# EAGLE design mxboard (EAGLE 7.1.0)
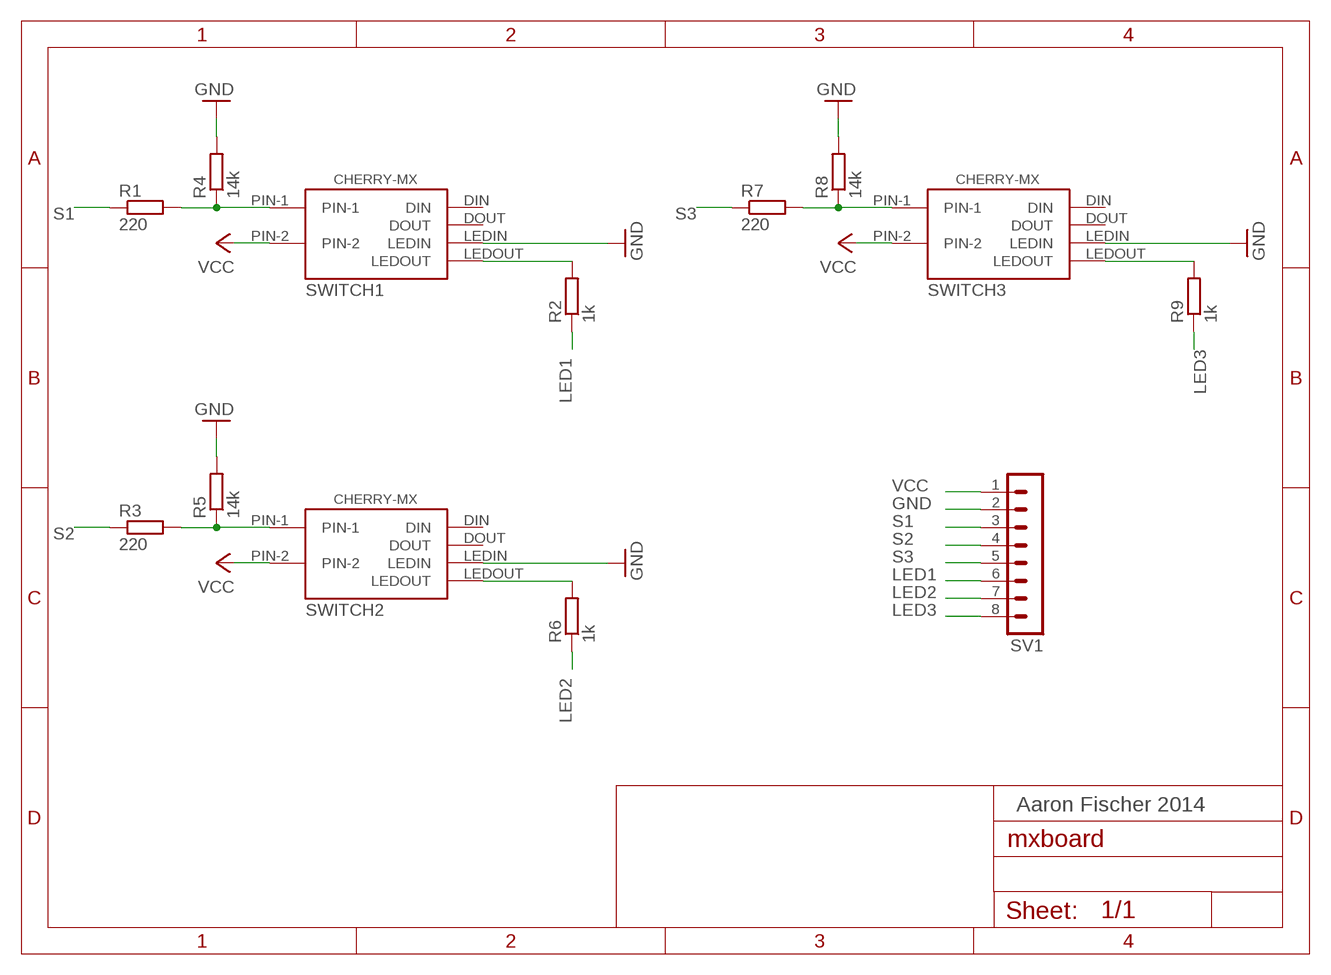
[diagram p0: schematic, sheet 1]

## Parts
R1  220  R-EU_R0805  [R0805]
R2  1k  R-EU_R0805  [R0805]
R3  220  R-EU_R0805  [R0805]
R4  14k  R-EU_R0805  [R0805]
R5  14k  R-EU_R0805  [R0805]
R6  1k  R-EU_R0805  [R0805]
R7  220  R-EU_R0805  [R0805]
R8  14k  R-EU_R0805  [R0805]
R9  1k  R-EU_R0805  [R0805]
SV1  MA08-1  [MA08-1]
SWITCH1  CHERRY-MX-I  [CHERRY-MX-I]
SWITCH2  CHERRY-MX-I  [CHERRY-MX-I]
SWITCH3  CHERRY-MX-I  [CHERRY-MX-I]

## Nets
GND: R4.2 R5.2 R8.2 SV1.2 SWITCH1.LEDIN SWITCH2.LEDIN SWITCH3.LEDIN
LED1: R2.1 SV1.6
LED2: R6.1 SV1.7
LED3: R9.1 SV1.8
N$1: R1.2 R4.1 SWITCH1.PIN-1
N$3: R2.2 SWITCH1.LEDOUT
N$5: R3.2 R5.1 SWITCH2.PIN-1
N$7: R6.2 SWITCH2.LEDOUT
N$9: R7.2 R8.1 SWITCH3.PIN-1
N$11: R9.2 SWITCH3.LEDOUT
S1: R1.1 SV1.3
S2: R3.1 SV1.4
S3: R7.1 SV1.5
VCC: SV1.1 SWITCH1.PIN-2 SWITCH2.PIN-2 SWITCH3.PIN-2
Unconnected: SWITCH1.DIN SWITCH1.DOUT SWITCH2.DIN SWITCH2.DOUT SWITCH3.DIN SWITCH3.DOUT

## Notes on the sheet
- Aaron Fischer 2014

## Library data of the parts
R1-R9 = resistor:R-EU_: RESISTOR, European symbol; SPICEPREFIX: R
SV1 = con-lstb:MA08-1: PIN HEADER; OC_FARNELL: unknown; OC_NEWARK: unknown
SWITCH1-SWITCH3 = cherrymx:CHERRY-MX-I

## Board
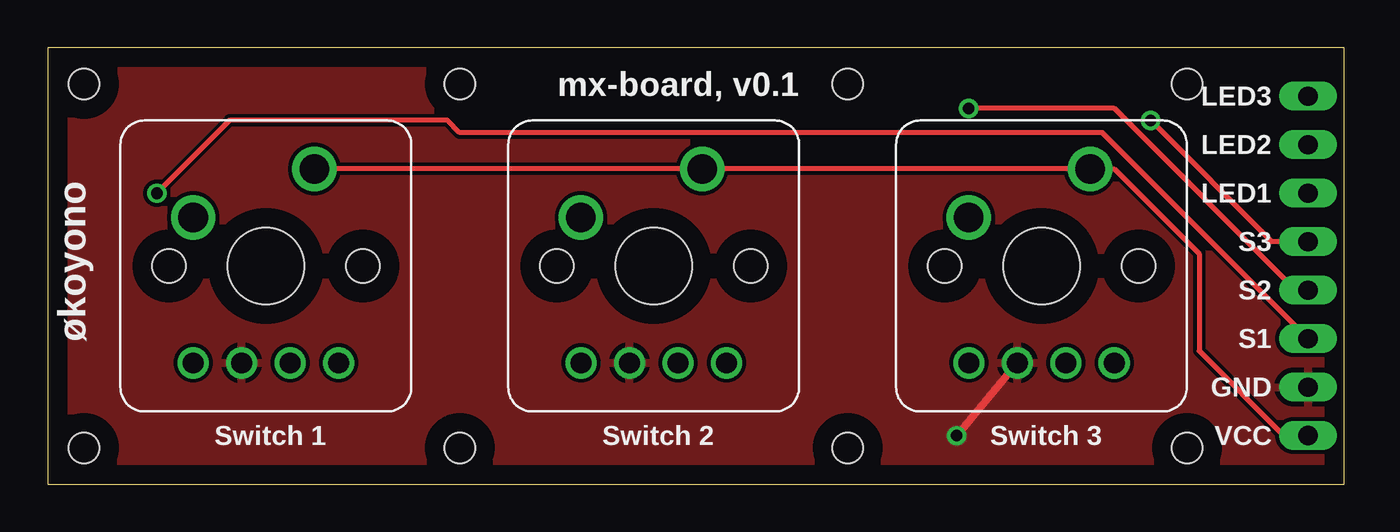
[diagram p1: board, top side]
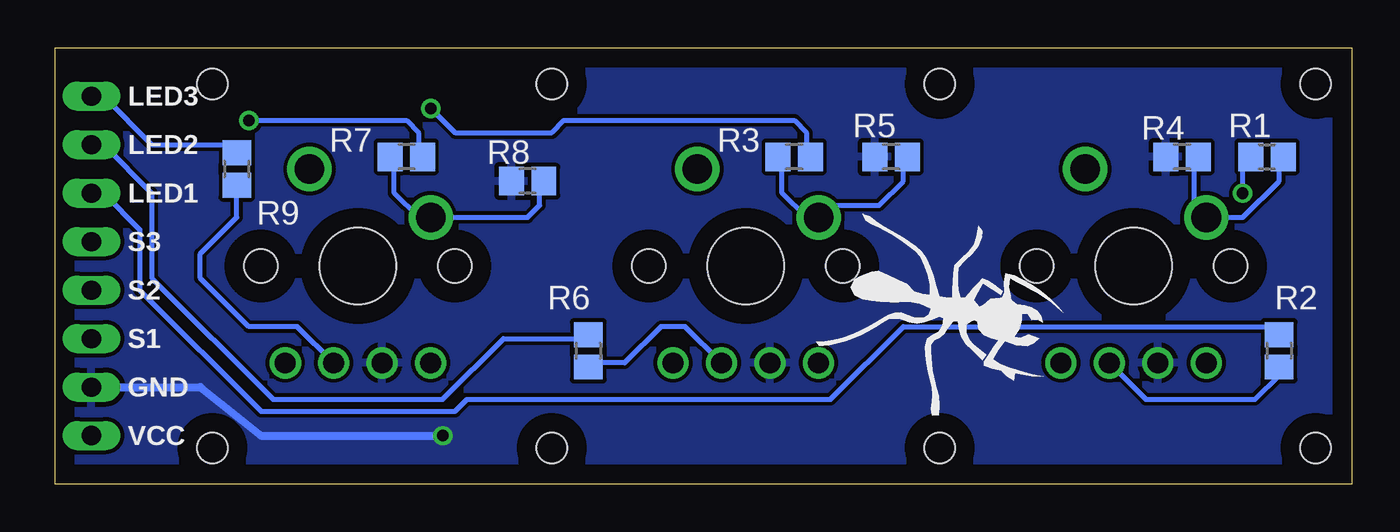
[diagram p2: board, bottom side, seen from below]

Size 67.94 x 22.86 mm. Coordinates in mm from the lower left corner, seen from the top.
Outline: 0,0 67.94,0 67.94,22.86 0,22.85 0,0
Copper layers (1*16): Top 0.035mm / dielectric 1.5mm / Bottom 0.035mm
Design rules "default": minimum track width 10mil, minimum drill 24mil, track to track 8mil, track to pad 8mil, pad to pad 8mil, via to via 8mil, smd to smd 8mil, copper to edge 40mil, drill to drill 8mil, minimum pad ring 10mil, minimum via ring 8mil, stop-mask expansion 4mil, vias tented up to drill 0mil, thermal gap 10mil
Holes 1.6 mm at 1.91,20.95 1.91,1.91 21.59,1.91 21.59,20.95 41.91,20.95 41.91,1.91 59.69,20.95 59.69,1.91

### Footprints (pad centres in the part's own frame; a part is rotated, then mirrored left to right if it is on the bottom)
R0805 = smd 1.3 x 1.5: 1 -0.85,0; 2 0.85,0
MA08-1 = drill 1.016 long: 1 -8.89,0; 2 -6.35,0; 3 -3.81,0; 4 -1.27,0; 5 1.27,0; 6 3.81,0; 7 6.35,0; 8 8.89,0
CHERRY-MX-I = drill 1.092: DIN -3.81,-5.08; DOUT 3.81,-5.08; LEDIN -1.27,-5.08; LEDOUT 1.27,-5.08 | drill 1.549 pad 2.286: PIN-1 -3.81,2.54; PIN-2 2.54,5.08 | hole 4: 0,0 | hole 1.753: -5.08,0; 5.08,0

### Placement (x,y rotation side)
R1  4.45,17.14 0 bottom
R2  3.81,6.99 270 bottom
R3  29.21,17.14 180 bottom
R4  8.89,17.14 180 bottom
R5  24.13,17.14 180 bottom
R6  40.01,6.99 270 bottom
R7  49.53,17.14 180 bottom
R8  43.18,15.88 180 bottom
R9  58.42,16.51 270 bottom
SV1  66.04,11.43 90 top
SWITCH1  11.43,11.43 0 top
SWITCH2  31.75,11.43 0 top
SWITCH3  52.07,11.43 0 top

### Tracks (layer width: path | path; a pad name or v marks a point on that pad's centre or on a via)
GND  (via drill 0.6)
  Top 0.406: v47.62,2.54 SWITCH3.LEDIN
  Bottom 0.406: SV1.2 60.33,5.08 57.15,2.54 v47.62,2.54
  pour Top: 0,22.86 67.94,22.86 67.94,0 0,0
  pour Bottom: 0,22.86 67.94,22.86 67.94,0 0,0
LED1
  Bottom 0.254: SV1.6 65.41,15.24 63.5,13.34 63.5,10.16 57.15,3.81 46.99,3.81 46.35,4.45 27.3,4.45 23.5,8.26 3.81,8.26 R2.1
LED2
  Bottom 0.254: SV1.7 65.41,17.78 62.87,15.24 62.87,10.79 56.52,4.45 47.62,4.45 44.45,7.62 40.01,7.62 R6.1
LED3
  Bottom 0.254: SV1.8 65.41,20.32 62.87,17.78 58.42,17.78 R9.1
N$1
  Bottom 0.254: R1.2 3.81,17.14 3.81,15.88 5.71,13.97 SWITCH1.PIN-1 8.26,14.61 8.26,17.14 R4.1
N$3
  Bottom 0.254: SWITCH1.LEDOUT 10.79,4.45 5.08,4.45 3.81,5.71 R2.2
N$5
  Bottom 0.254: R5.1 23.5,17.14 23.5,15.88 24.77,14.61 27.3,14.61 SWITCH2.PIN-1 28.57,13.97 29.84,15.24 29.84,17.14 R3.2
N$7
  Bottom 0.254: SWITCH2.LEDOUT 34.92,8.26 36.2,8.26 38.1,6.35 40.01,6.35 R6.2
N$9
  Bottom 0.254: R8.1 42.55,15.88 42.55,14.61 43.18,13.97 SWITCH3.PIN-1 48.9,13.97 50.16,15.24 50.16,17.14 R7.2
N$11
  Bottom 0.254: R9.2 58.42,13.97 60.33,12.06 60.33,10.79 57.78,8.26 55.24,8.26 SWITCH3.LEDOUT
S1  (via drill 0.61)
  Top 0.254: v5.71,15.24 9.53,19.05 20.95,19.05 21.59,18.41 55.24,18.41 SV1.3
  Bottom 0.254: v5.71,15.24 5.71,17.14 R1.1
S2  (via drill 0.61)
  Top 0.254: v48.26,19.68 55.88,19.68 65.41,10.16 SV1.4
  Bottom 0.254: v48.26,19.68 46.99,18.41 41.91,18.41 41.27,19.05 29.21,19.05 28.57,18.41 28.57,17.14 R3.1
S3  (via drill 0.61)
  Top 0.254: v57.78,19.05 64.14,12.7 SV1.5
  Bottom 0.254: v57.78,19.05 49.53,19.05 48.9,18.41 48.9,17.14 R7.1
VCC
  Top 0.254: SWITCH1.PIN-2 SWITCH2.PIN-2 SWITCH3.PIN-2 55.88,16.51 60.33,12.06 60.33,6.99 64.77,2.54 SV1.1

### Text on the board
tNames: mx-board, v0.1 | LED3 | LED2 | økoyono | LED1 | S3 | S2 | S1 | GND | Switch 1 | Switch 2 | Switch 3 | VCC
bNames: LED3 | LED2 | LED1 | S3 | S2 | S1 | GND | VCC